# EAGLE schematic diybmsv4-00_panels (EAGLE 6.1)
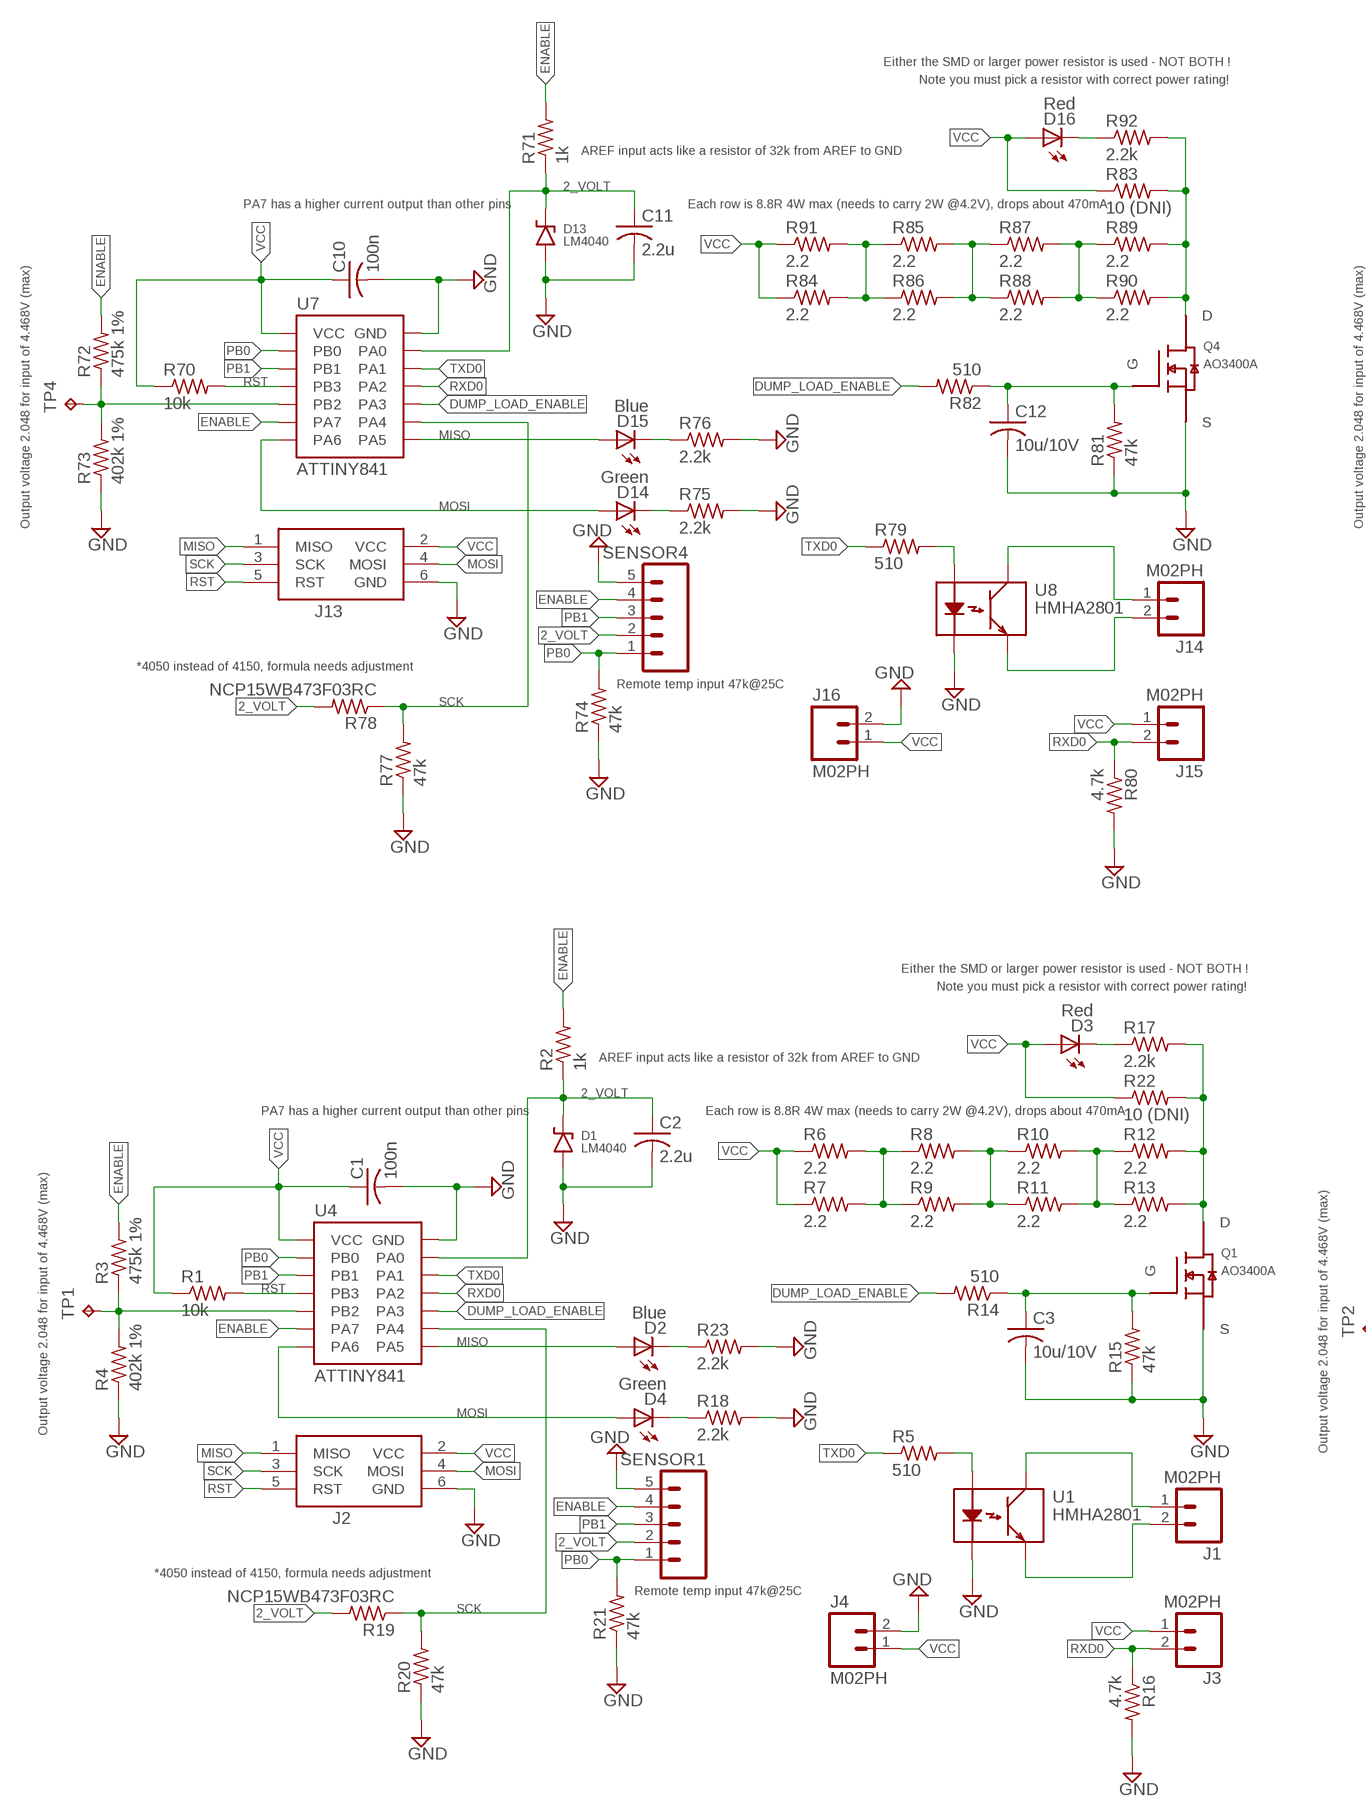
[diagram p0: schematic, sheet 1, part 1 of 2]
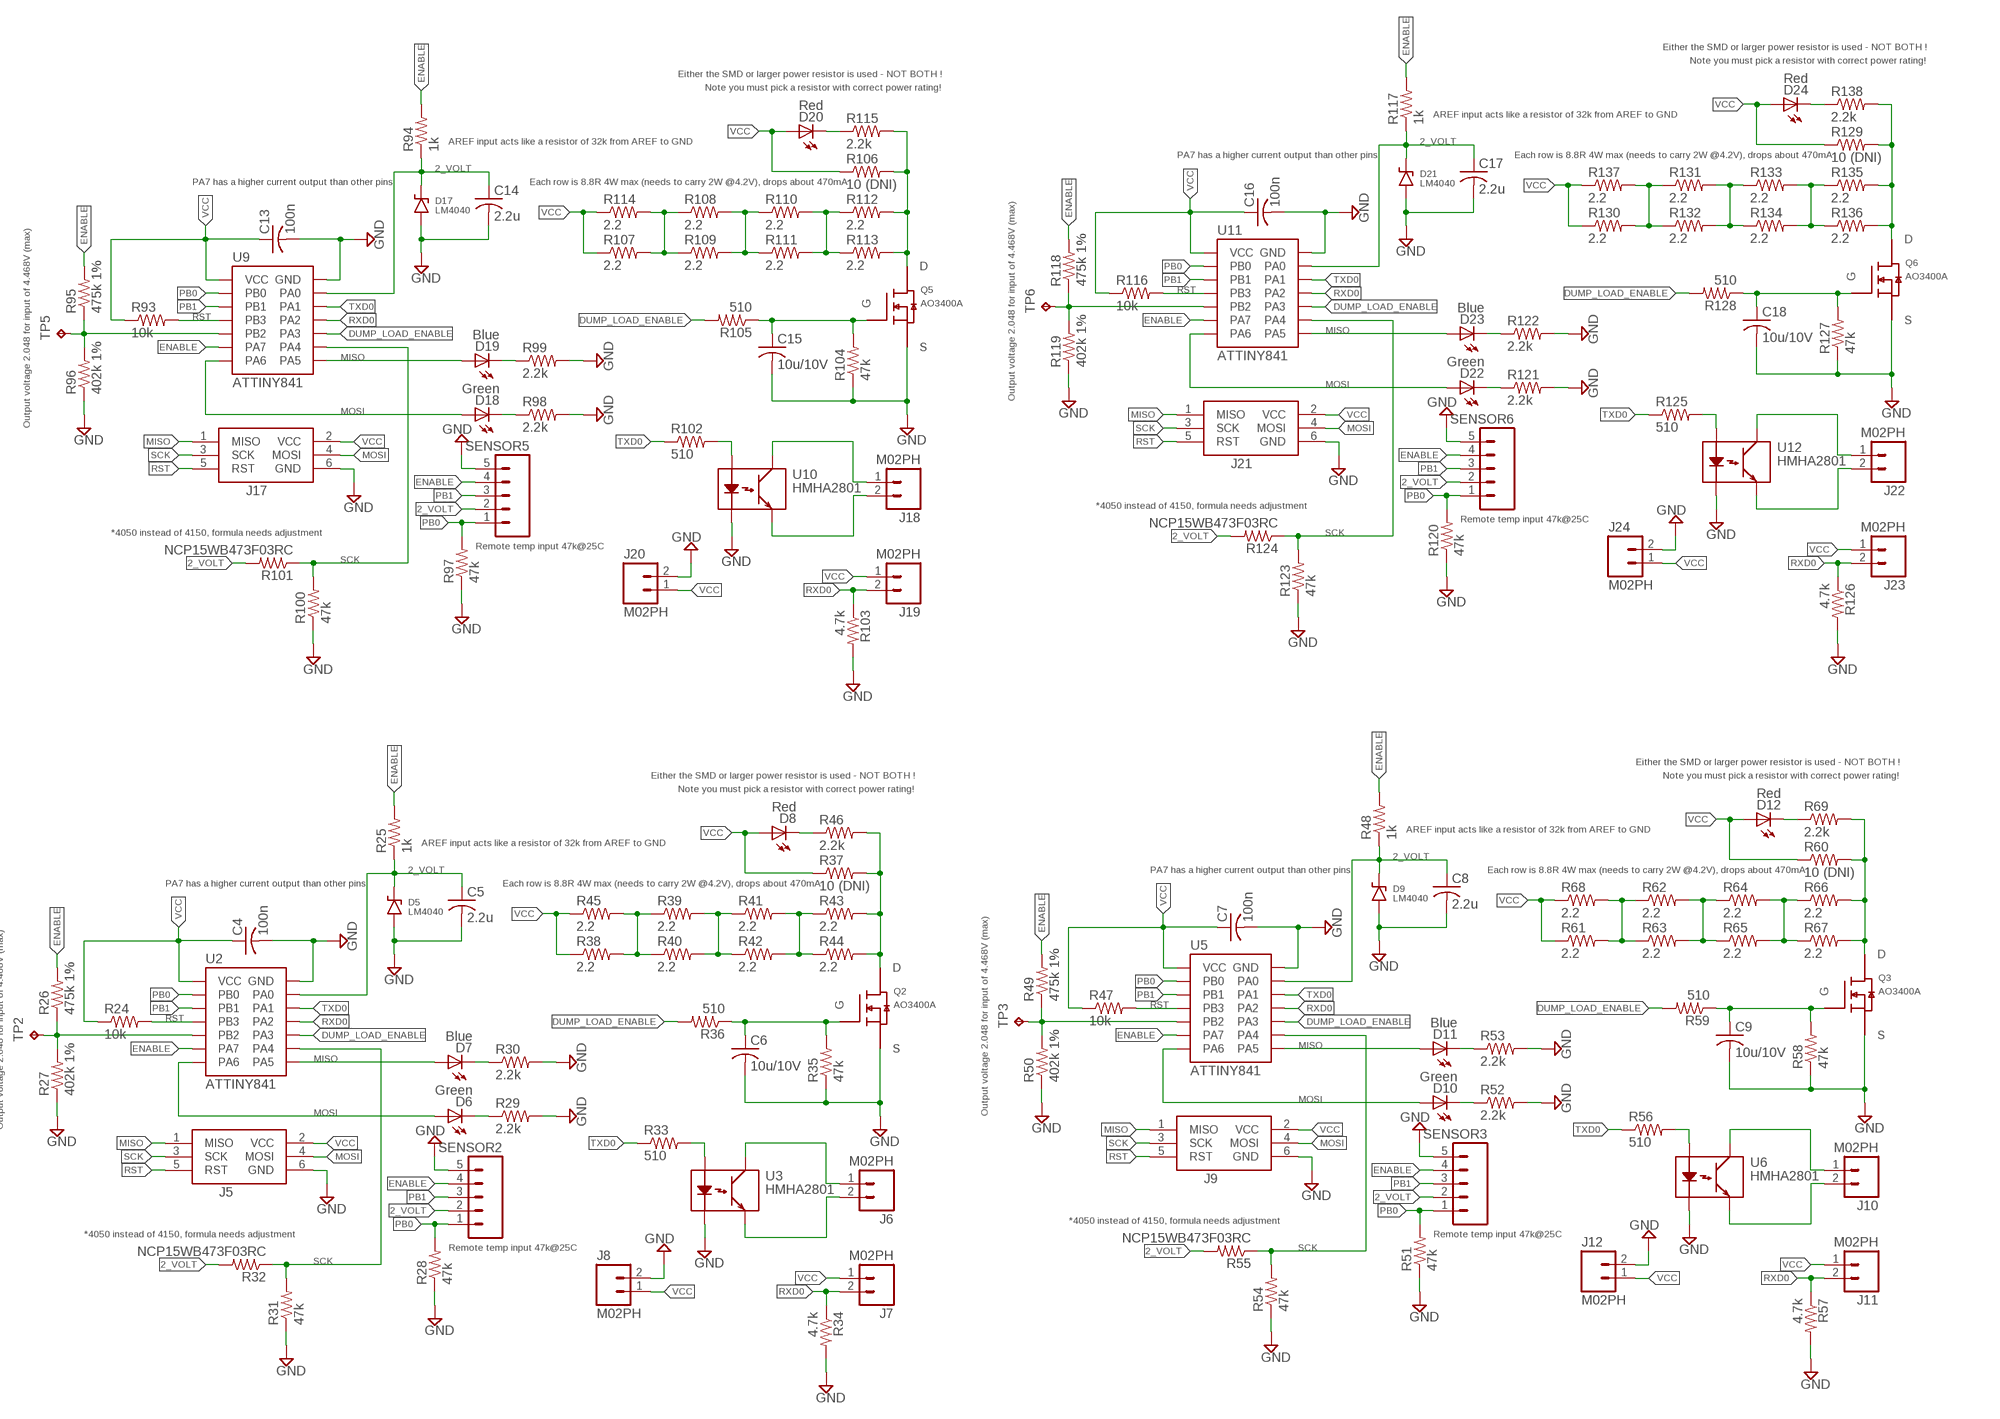
[diagram p1: schematic, sheet 1, part 2 of 2]

## Parts
C1  100n  C-USC0402  [C0402]
C2  2.2u  C-USC0402  [C0402]
C3  10u/10V  C-USC0402  [C0402]
C4  100n  C-USC0402  [C0402]
C5  2.2u  C-USC0402  [C0402]
C6  10u/10V  C-USC0402  [C0402]
C7  100n  C-USC0402  [C0402]
C8  2.2u  C-USC0402  [C0402]
C9  10u/10V  C-USC0402  [C0402]
C10  100n  C-USC0402  [C0402]
C11  2.2u  C-USC0402  [C0402]
C12  10u/10V  C-USC0402  [C0402]
C13  100n  C-USC0402  [C0402]
C14  2.2u  C-USC0402  [C0402]
C15  10u/10V  C-USC0402  [C0402]
C16  100n  C-USC0402  [C0402]
C17  2.2u  C-USC0402  [C0402]
C18  10u/10V  C-USC0402  [C0402]
D1  LM4040  [SOT23]
D2  Blue  LEDCHIPLED_0603  [CHIPLED_0603]
D3  Red  LEDCHIPLED_0603  [CHIPLED_0603]
D4  Green  LEDCHIPLED_0603  [CHIPLED_0603]
D5  LM4040  [SOT23]
D6  Green  LEDCHIPLED_0603  [CHIPLED_0603]
D7  Blue  LEDCHIPLED_0603  [CHIPLED_0603]
D8  Red  LEDCHIPLED_0603  [CHIPLED_0603]
D9  LM4040  [SOT23]
D10  Green  LEDCHIPLED_0603  [CHIPLED_0603]
D11  Blue  LEDCHIPLED_0603  [CHIPLED_0603]
D12  Red  LEDCHIPLED_0603  [CHIPLED_0603]
D13  LM4040  [SOT23]
D14  Green  LEDCHIPLED_0603  [CHIPLED_0603]
D15  Blue  LEDCHIPLED_0603  [CHIPLED_0603]
D16  Red  LEDCHIPLED_0603  [CHIPLED_0603]
D17  LM4040  [SOT23]
D18  Green  LEDCHIPLED_0603  [CHIPLED_0603]
D19  Blue  LEDCHIPLED_0603  [CHIPLED_0603]
D20  Red  LEDCHIPLED_0603  [CHIPLED_0603]
D21  LM4040  [SOT23]
D22  Green  LEDCHIPLED_0603  [CHIPLED_0603]
D23  Blue  LEDCHIPLED_0603  [CHIPLED_0603]
D24  Red  LEDCHIPLED_0603  [CHIPLED_0603]
J1  M02PH  [S2B-PH-RA]
J2  AVRISP-6  [AVRISP]
J3  M02PH  [S2B-PH-RA]
J4  M02PH  [S2B-PH-RA]
J5  AVRISP-6  [AVRISP]
J6  M02PH  [S2B-PH-RA]
J7  M02PH  [S2B-PH-RA]
J8  M02PH  [S2B-PH-RA]
J9  AVRISP-6  [AVRISP]
J10  M02PH  [S2B-PH-RA]
J11  M02PH  [S2B-PH-RA]
J12  M02PH  [S2B-PH-RA]
J13  AVRISP-6  [AVRISP]
J14  M02PH  [S2B-PH-RA]
J15  M02PH  [S2B-PH-RA]
J16  M02PH  [S2B-PH-RA]
J17  AVRISP-6  [AVRISP]
J18  M02PH  [S2B-PH-RA]
J19  M02PH  [S2B-PH-RA]
J20  M02PH  [S2B-PH-RA]
J21  AVRISP-6  [AVRISP]
J22  M02PH  [S2B-PH-RA]
J23  M02PH  [S2B-PH-RA]
J24  M02PH  [S2B-PH-RA]
Q1  AO3400A  AO3414  [SOT23]
Q2  AO3400A  AO3414  [SOT23]
Q3  AO3400A  AO3414  [SOT23]
Q4  AO3400A  AO3414  [SOT23]
Q5  AO3400A  AO3414  [SOT23]
Q6  AO3400A  AO3414  [SOT23]
R1  10k  R-US_R0402  [R0402]
R2  1k  R-US_R0402  [R0402]
R3  475k 1%  R-US_R0402  [R0402]
R4  402k 1%  R-US_R0402  [R0402]
R5  510  R-US_R0402  [R0402]
R6  2.2  R-US_R2512  [R2512]
R7  2.2  R-US_R2512  [R2512]
R8  2.2  R-US_R2512  [R2512]
R9  2.2  R-US_R2512  [R2512]
R10  2.2  R-US_R2512  [R2512]
R11  2.2  R-US_R2512  [R2512]
R12  2.2  R-US_R2512  [R2512]
R13  2.2  R-US_R2512  [R2512]
R14  510  R-US_R0402  [R0402]
R15  47k  R-US_R0402  [R0402]
R16  4.7k  R-US_R0402  [R0402]
R17  2.2k  R-US_R0402  [R0402]
R18  2.2k  R-US_R0402  [R0402]
R19  NCP15WB473F03RC  R-US_R0402  [R0402]
R20  47k  R-US_R0402  [R0402]
R21  47k  R-US_R0402  [R0402]
R22  10 (DNI)  RESISTOR25MM  [R-5W-22X9P5X9P5]
R23  2.2k  R-US_R0402  [R0402]
R24  10k  R-US_R0402  [R0402]
R25  1k  R-US_R0402  [R0402]
R26  475k 1%  R-US_R0402  [R0402]
R27  402k 1%  R-US_R0402  [R0402]
R28  47k  R-US_R0402  [R0402]
R29  2.2k  R-US_R0402  [R0402]
R30  2.2k  R-US_R0402  [R0402]
R31  47k  R-US_R0402  [R0402]
R32  NCP15WB473F03RC  R-US_R0402  [R0402]
R33  510  R-US_R0402  [R0402]
R34  4.7k  R-US_R0402  [R0402]
R35  47k  R-US_R0402  [R0402]
R36  510  R-US_R0402  [R0402]
R37  10 (DNI)  RESISTOR25MM  [R-5W-22X9P5X9P5]
R38  2.2  R-US_R2512  [R2512]
R39  2.2  R-US_R2512  [R2512]
R40  2.2  R-US_R2512  [R2512]
R41  2.2  R-US_R2512  [R2512]
R42  2.2  R-US_R2512  [R2512]
R43  2.2  R-US_R2512  [R2512]
R44  2.2  R-US_R2512  [R2512]
R45  2.2  R-US_R2512  [R2512]
R46  2.2k  R-US_R0402  [R0402]
R47  10k  R-US_R0402  [R0402]
R48  1k  R-US_R0402  [R0402]
R49  475k 1%  R-US_R0402  [R0402]
R50  402k 1%  R-US_R0402  [R0402]
R51  47k  R-US_R0402  [R0402]
R52  2.2k  R-US_R0402  [R0402]
R53  2.2k  R-US_R0402  [R0402]
R54  47k  R-US_R0402  [R0402]
R55  NCP15WB473F03RC  R-US_R0402  [R0402]
R56  510  R-US_R0402  [R0402]
R57  4.7k  R-US_R0402  [R0402]
R58  47k  R-US_R0402  [R0402]
R59  510  R-US_R0402  [R0402]
R60  10 (DNI)  RESISTOR25MM  [R-5W-22X9P5X9P5]
R61  2.2  R-US_R2512  [R2512]
R62  2.2  R-US_R2512  [R2512]
R63  2.2  R-US_R2512  [R2512]
R64  2.2  R-US_R2512  [R2512]
R65  2.2  R-US_R2512  [R2512]
R66  2.2  R-US_R2512  [R2512]
R67  2.2  R-US_R2512  [R2512]
R68  2.2  R-US_R2512  [R2512]
R69  2.2k  R-US_R0402  [R0402]
R70  10k  R-US_R0402  [R0402]
R71  1k  R-US_R0402  [R0402]
R72  475k 1%  R-US_R0402  [R0402]
R73  402k 1%  R-US_R0402  [R0402]
R74  47k  R-US_R0402  [R0402]
R75  2.2k  R-US_R0402  [R0402]
R76  2.2k  R-US_R0402  [R0402]
R77  47k  R-US_R0402  [R0402]
R78  NCP15WB473F03RC  R-US_R0402  [R0402]
R79  510  R-US_R0402  [R0402]
R80  4.7k  R-US_R0402  [R0402]
R81  47k  R-US_R0402  [R0402]
R82  510  R-US_R0402  [R0402]
R83  10 (DNI)  RESISTOR25MM  [R-5W-22X9P5X9P5]
R84  2.2  R-US_R2512  [R2512]
R85  2.2  R-US_R2512  [R2512]
R86  2.2  R-US_R2512  [R2512]
R87  2.2  R-US_R2512  [R2512]
R88  2.2  R-US_R2512  [R2512]
R89  2.2  R-US_R2512  [R2512]
R90  2.2  R-US_R2512  [R2512]
R91  2.2  R-US_R2512  [R2512]
R92  2.2k  R-US_R0402  [R0402]
R93  10k  R-US_R0402  [R0402]
R94  1k  R-US_R0402  [R0402]
R95  475k 1%  R-US_R0402  [R0402]
R96  402k 1%  R-US_R0402  [R0402]
R97  47k  R-US_R0402  [R0402]
R98  2.2k  R-US_R0402  [R0402]
R99  2.2k  R-US_R0402  [R0402]
R100  47k  R-US_R0402  [R0402]
R101  NCP15WB473F03RC  R-US_R0402  [R0402]
R102  510  R-US_R0402  [R0402]
R103  4.7k  R-US_R0402  [R0402]
R104  47k  R-US_R0402  [R0402]
R105  510  R-US_R0402  [R0402]
R106  10 (DNI)  RESISTOR25MM  [R-5W-22X9P5X9P5]
R107  2.2  R-US_R2512  [R2512]
R108  2.2  R-US_R2512  [R2512]
R109  2.2  R-US_R2512  [R2512]
R110  2.2  R-US_R2512  [R2512]
R111  2.2  R-US_R2512  [R2512]
R112  2.2  R-US_R2512  [R2512]
R113  2.2  R-US_R2512  [R2512]
R114  2.2  R-US_R2512  [R2512]
R115  2.2k  R-US_R0402  [R0402]
R116  10k  R-US_R0402  [R0402]
R117  1k  R-US_R0402  [R0402]
R118  475k 1%  R-US_R0402  [R0402]
R119  402k 1%  R-US_R0402  [R0402]
R120  47k  R-US_R0402  [R0402]
R121  2.2k  R-US_R0402  [R0402]
R122  2.2k  R-US_R0402  [R0402]
R123  47k  R-US_R0402  [R0402]
R124  NCP15WB473F03RC  R-US_R0402  [R0402]
R125  510  R-US_R0402  [R0402]
R126  4.7k  R-US_R0402  [R0402]
R127  47k  R-US_R0402  [R0402]
R128  510  R-US_R0402  [R0402]
R129  10 (DNI)  RESISTOR25MM  [R-5W-22X9P5X9P5]
R130  2.2  R-US_R2512  [R2512]
R131  2.2  R-US_R2512  [R2512]
R132  2.2  R-US_R2512  [R2512]
R133  2.2  R-US_R2512  [R2512]
R134  2.2  R-US_R2512  [R2512]
R135  2.2  R-US_R2512  [R2512]
R136  2.2  R-US_R2512  [R2512]
R137  2.2  R-US_R2512  [R2512]
R138  2.2k  R-US_R0402  [R0402]
SENSOR1  M05PTH  [1X05]
SENSOR2  M05PTH  [1X05]
SENSOR3  M05PTH  [1X05]
SENSOR4  M05PTH  [1X05]
SENSOR5  M05PTH  [1X05]
SENSOR6  M05PTH  [1X05]
TP1  TPTP15SQ  [TP15SQ]
TP2  TPTP15SQ  [TP15SQ]
TP3  TPTP15SQ  [TP15SQ]
TP4  TPTP15SQ  [TP15SQ]
TP5  TPTP15SQ  [TP15SQ]
TP6  TPTP15SQ  [TP15SQ]
U1  HMHA2801  [4-SOIC]
U2  ATTINY841  [14-SOIC]
U3  HMHA2801  [4-SOIC]
U4  ATTINY841  [14-SOIC]
U5  ATTINY841  [14-SOIC]
U6  HMHA2801  [4-SOIC]
U7  ATTINY841  [14-SOIC]
U8  HMHA2801  [4-SOIC]
U9  ATTINY841  [14-SOIC]
U10  HMHA2801  [4-SOIC]
U11  ATTINY841  [14-SOIC]
U12  HMHA2801  [4-SOIC]

## Nets
2_VOLT: C2.1 C5.1 C8.1 C11.1 C14.1 C17.1 D1.1(K) D5.1(K) D9.1(K) D13.1(K) D17.1(K) D21.1(K) R2.1 R19.2 R25.1 R32.2 R48.1 R55.2 R71.1 R78.2 R94.1 R101.2 R117.1 R124.2 SENSOR1.2 SENSOR2.2 SENSOR3.2 SENSOR4.2 SENSOR5.2 SENSOR6.2 U2.13(PA0) U4.13(PA0) U5.13(PA0) U7.13(PA0) U9.13(PA0) U11.13(PA0)
DLLED: D3.C R17.1
DLLED1: D8.C R46.1
DLLED2: D12.C R69.1
DLLED3: D16.C R92.1
DLLED4: D20.C R115.1
DLLED5: D24.C R138.1
DRAIN: Q1.3(D) R12.2 R13.2 R17.2 R22.2
DRAIN1: Q2.3(D) R37.2 R43.2 R44.2 R46.2
DRAIN2: Q3.3(D) R60.2 R66.2 R67.2 R69.2
DRAIN3: Q4.3(D) R83.2 R89.2 R90.2 R92.2
DRAIN4: Q5.3(D) R106.2 R112.2 R113.2 R115.2
DRAIN5: Q6.3(D) R129.2 R135.2 R136.2 R138.2
DUMP_LOAD_ENABLE: R14.2 R36.2 R59.2 R82.2 R105.2 R128.2 U2.10(PA3) U4.10(PA3) U5.10(PA3) U7.10(PA3) U9.10(PA3) U11.10(PA3)
ENABLE: R2.2 R3.2 R25.2 R26.2 R48.2 R49.2 R71.2 R72.2 R94.2 R95.2 R117.2 R118.2 SENSOR1.4 SENSOR2.4 SENSOR3.4 SENSOR4.4 SENSOR5.4 SENSOR6.4 U2.6(PA7) U4.6(PA7) U5.6(PA7) U7.6(PA7) U9.6(PA7) U11.6(PA7)
GATE: C3.1 Q1.1(G) R14.1 R15.2
GATE1: C6.1 Q2.1(G) R35.2 R36.1
GATE2: C9.1 Q3.1(G) R58.2 R59.1
GATE3: C12.1 Q4.1(G) R81.2 R82.1
GATE4: C15.1 Q5.1(G) R104.2 R105.1
GATE5: C18.1 Q6.1(G) R127.2 R128.1
GND: C1.2 C2.2 C3.2 C4.2 C5.2 C6.2 C7.2 C8.2 C9.2 C10.2 C11.2 C12.2 C13.2 C14.2 C15.2 C16.2 C17.2 C18.2 D1.2(A) D5.2(A) D9.2(A) D13.2(A) D17.2(A) D21.2(A) J2.6(GND) J4.2 J5.6(GND) J8.2 J9.6(GND) J12.2 J13.6(GND) J16.2 J17.6(GND) J20.2 J21.6(GND) J24.2 Q1.2(S) Q2.2(S) Q3.2(S) Q4.2(S) Q5.2(S) Q6.2(S) R4.1 R15.1 R16.2 R18.2 R20.1 R21.1 R23.2 R27.1 R28.1 R29.2 R30.2 R31.1 R34.2 R35.1 R50.1 R51.1 R52.2 R53.2 R54.1 R57.2 R58.1 R73.1 R74.1 R75.2 R76.2 R77.1 R80.2 R81.1 R96.1 R97.1 R98.2 R99.2 R100.1 R103.2 R104.1 R119.1 R120.1 R121.2 R122.2 R123.1 R126.2 R127.1 SENSOR1.5 SENSOR2.5 SENSOR3.5 SENSOR4.5 SENSOR5.5 SENSOR6.5 U1.2(K) U2.14(GND) U3.2(K) U4.14(GND) U5.14(GND) U6.2(K) U7.14(GND) U8.2(K) U9.14(GND) U10.2(K) U11.14(GND) U12.2(K)
MISO: D2.A D7.A D11.A D15.A D19.A D23.A J2.1(MISO) J5.1(MISO) J9.1(MISO) J13.1(MISO) J17.1(MISO) J21.1(MISO) U2.8(PA5) U4.8(PA5) U5.8(PA5) U7.8(PA5) U9.8(PA5) U11.8(PA5)
MOSI: D4.A D6.A D10.A D14.A D18.A D22.A J2.4(MOSI) J5.4(MOSI) J9.4(MOSI) J13.4(MOSI) J17.4(MOSI) J21.4(MOSI) U2.7(PA6) U4.7(PA6) U5.7(PA6) U7.7(PA6) U9.7(PA6) U11.7(PA6)
N$1: J1.1 U1.4(C)
N$2: J1.2 U1.3(E)
N$3: D4.C R18.1
N$4: D2.C R23.1
N$5: R5.2 U1.1(A)
N$6: D6.C R29.1
N$7: D7.C R30.1
N$8: J6.1 U3.4(C)
N$9: J6.2 U3.3(E)
N$10: R33.2 U3.1(A)
N$11: D10.C R52.1
N$12: D11.C R53.1
N$13: J10.1 U6.4(C)
N$14: J10.2 U6.3(E)
N$15: R56.2 U6.1(A)
N$16: D14.C R75.1
N$17: D15.C R76.1
N$18: J14.1 U8.4(C)
N$19: J14.2 U8.3(E)
N$20: R79.2 U8.1(A)
N$21: D18.C R98.1
N$22: D19.C R99.1
N$23: J18.1 U10.4(C)
N$24: J18.2 U10.3(E)
N$25: R102.2 U10.1(A)
N$26: D22.C R121.1
N$27: D23.C R122.1
N$28: J22.1 U12.4(C)
N$29: J22.2 U12.3(E)
N$30: R125.2 U12.1(A)
PB0: R21.2 R28.2 R51.2 R74.2 R97.2 R120.2 SENSOR1.1 SENSOR2.1 SENSOR3.1 SENSOR4.1 SENSOR5.1 SENSOR6.1 U2.2(PB0) U4.2(PB0) U5.2(PB0) U7.2(PB0) U9.2(PB0) U11.2(PB0)
PB1: SENSOR1.3 SENSOR2.3 SENSOR3.3 SENSOR4.3 SENSOR5.3 SENSOR6.3 U2.3(PB1) U4.3(PB1) U5.3(PB1) U7.3(PB1) U9.3(PB1) U11.3(PB1)
PB2: R3.1 R4.2 TP1.TP U4.5(PB2)
PB3: R26.1 R27.2 TP2.TP U2.5(PB2)
PB4: R49.1 R50.2 TP3.TP U5.5(PB2)
PB5: R72.1 R73.2 TP4.TP U7.5(PB2)
PB6: R95.1 R96.2 TP5.TP U9.5(PB2)
PB7: R118.1 R119.2 TP6.TP U11.5(PB2)
R1: R39.2 R40.2 R41.1 R42.1
R2: R41.2 R42.2 R43.1 R44.1
R3: R38.2 R39.1 R40.1 R45.2
R4: R62.2 R63.2 R64.1 R65.1
R5: R64.2 R65.2 R66.1 R67.1
R6: R61.2 R62.1 R63.1 R68.2
R7: R85.2 R86.2 R87.1 R88.1
R8: R87.2 R88.2 R89.1 R90.1
R9: R84.2 R85.1 R86.1 R91.2
R10: R108.2 R109.2 R110.1 R111.1
R11: R110.2 R111.2 R112.1 R113.1
R12: R107.2 R108.1 R109.1 R114.2
R13: R131.2 R132.2 R133.1 R134.1
R14: R133.2 R134.2 R135.1 R136.1
R15: R130.2 R131.1 R132.1 R137.2
R6789: R6.2 R7.2 R8.1 R9.1
R891011: R8.2 R9.2 R10.1 R11.1
R10111213: R10.2 R11.2 R12.1 R13.1
RST: J2.5(RST) J5.5(RST) J9.5(RST) J13.5(RST) J17.5(RST) J21.5(RST) R1.2 R24.2 R47.2 R70.2 R93.2 R116.2 U2.4(PB3) U4.4(PB3) U5.4(PB3) U7.4(PB3) U9.4(PB3) U11.4(PB3)
RXD0: J3.2 J7.2 J11.2 J15.2 J19.2 J23.2 R16.1 R34.1 R57.1 R80.1 R103.1 R126.1 U2.11(PA2) U4.11(PA2) U5.11(PA2) U7.11(PA2) U9.11(PA2) U11.11(PA2)
SCK: J2.3(SCK) J5.3(SCK) J9.3(SCK) J13.3(SCK) J17.3(SCK) J21.3(SCK) R19.1 R20.2 R31.2 R32.1 R54.2 R55.1 R77.2 R78.1 R100.2 R101.1 R123.2 R124.1 U2.9(PA4) U4.9(PA4) U5.9(PA4) U7.9(PA4) U9.9(PA4) U11.9(PA4)
TXD0: R5.1 R33.1 R56.1 R79.1 R102.1 R125.1 U2.12(PA1) U4.12(PA1) U5.12(PA1) U7.12(PA1) U9.12(PA1) U11.12(PA1)
VCC: C1.1 C4.1 C7.1 C10.1 C13.1 C16.1 D3.A D8.A D12.A D16.A D20.A D24.A J2.2(VCC) J3.1 J4.1 J5.2(VCC) J7.1 J8.1 J9.2(VCC) J11.1 J12.1 J13.2(VCC) J15.1 J16.1 J17.2(VCC) J19.1 J20.1 J21.2(VCC) J23.1 J24.1 R1.1 R6.1 R7.1 R22.1 R24.1 R37.1 R38.1 R45.1 R47.1 R60.1 R61.1 R68.1 R70.1 R83.1 R84.1 R91.1 R93.1 R106.1 R107.1 R114.1 R116.1 R129.1 R130.1 R137.1 U2.1(VCC) U4.1(VCC) U5.1(VCC) U7.1(VCC) U9.1(VCC) U11.1(VCC)

## Notes on the sheet
- Either the SMD or larger power resistor is used - NOT BOTH !
- Note you must pick a resistor with correct power rating!
- Either the SMD or larger power resistor is used - NOT BOTH ! | Either the SMD or larger power resistor is used - NOT BOTH !
- Note you must pick a resistor with correct power rating! | Note you must pick a resistor with correct power rating!
- AREF input acts like a resistor of 32k from AREF to GND
- AREF input acts like a resistor of 32k from AREF to GND | AREF input acts like a resistor of 32k from AREF to GND
- PA7 has a higher current output than other pins | Each row is 8.8R 4W max (needs to carry 2W @4.2V), drops about 470mA
- PA7 has a higher current output than other pins | Each row is 8.8R 4W max (needs to carry 2W @4.2V), drops about 470mA | PA7 has a higher current output than other pins | Each row is 8.8R 4W max (needs to carry 2W @4.2V), drops about 470mA
- Output voltage 2.048 for input of 4.468V (max)
- Output voltage 2.048 for input of 4.468V (max) | Output voltage 2.048 for input of 4.468V (max)
- *4050 instead of 4150, formula needs adjustment
- Remote temp input 47k@25C
- *4050 instead of 4150, formula needs adjustment | *4050 instead of 4150, formula needs adjustment
- Remote temp input 47k@25C | Remote temp input 47k@25C
- Either the SMD or larger power resistor is used - NOT BOTH ! | Either the SMD or larger power resistor is used - NOT BOTH !
- Note you must pick a resistor with correct power rating! | Either the SMD or larger power resistor is used - NOT BOTH ! | Note you must pick a resistor with correct power rating!
- Note you must pick a resistor with correct power rating!
- AREF input acts like a resistor of 32k from AREF to GND | AREF input acts like a resistor of 32k from AREF to GND
- AREF input acts like a resistor of 32k from AREF to GND
- PA7 has a higher current output than other pins | Each row is 8.8R 4W max (needs to carry 2W @4.2V), drops about 470mA | PA7 has a higher current output than other pins | Each row is 8.8R 4W max (needs to carry 2W @4.2V), drops about 470mA
- PA7 has a higher current output than other pins | Each row is 8.8R 4W max (needs to carry 2W @4.2V), drops about 470mA
- Output voltage 2.048 for input of 4.468V (max) | Output voltage 2.048 for input of 4.468V (max)
- Output voltage 2.048 for input of 4.468V (max)
- *4050 instead of 4150, formula needs adjustment | *4050 instead of 4150, formula needs adjustment
- Remote temp input 47k@25C | *4050 instead of 4150, formula needs adjustment | Remote temp input 47k@25C
- Remote temp input 47k@25C

## Library data of the parts
C1-C18 = resistor:C-US: CAPACITOR, American symbol
D1 D5 D9 D13 D17 D21 = custom:LM4040: Voltage Reference Shunt 73uA
D2-D4 D6-D8 D10-D12 D14-D16 D18-D20 D22-D24 = led:LED: LED OSRAM: - CHIPLED LG R971, LG N971, LY N971, LG Q971, LY Q971, LO R971, LY R971 LH N974, LH R974 LS Q976, LO Q976, LY Q976 LO Q996 - Hyper CHIPLED LW Q18S LB Q993, LB Q99A, LB R99A - SideLED LS A670, LO A670, LY A670, LG A670, LP A670 LB A673, LV A673, LT A673, LW A673 LH A674 LY A675 LS A676, LA A676, LO A676, LY A676, LW A676 LS A679, LY A679, LG A679 - Hyper Micro SIDELED® LS Y876, LA Y876, LO Y876, LY Y876 LT Y87S - SmartLED LW L88C, LW L88S LB L89C, LB L89S, LG L890 LS L89K, LO L89K, LY L89K LS L896, LA L896, LO L896, LY L896 - TOPLED LS T670, LO T670, LY T670, LG T670, LP T670 LSG T670, LSP T670, LSY T670, LOP T670, LYG T670 LG T671, LOG T671, LSG T671 LB T673, LV T673, LT T673, LW T673 LH T674 LS T676, LA T676, LO T676, LY T676, LB T676, LH T676, LSB T676, LW T676 LB T67C, LV T67C, LT T67C, LS T67K, LO T67K, LY T67K, LW E67C LS E67B, LA E67B, LO E67B, LY E67B, LB E67C, LV E67C, LT E67C LW T67C LS T679, LY T679, LG T679 LS T770, LO T770, LY T770, LG T770, LP T770 LB T773, LV T773, LT T773, LW T773 LH T774 LS E675, LA E675, LY E675, LS T675 LS T776, LA T776, LO T776, LY T776, LB T776 LHGB T686 LT T68C, LB T68C - Hyper Mini TOPLED® LB M676 - Mini TOPLED Santana® LG M470 LS M47K, LO M47K, LY M47K Source: http://www.osram.convergy.de LUXEON: - LUMILED® LXK2-PW12-R00, LXK2-PW12-S00, LXK2-PW14-U00, LXK2-PW14-V00 LXK2-PM12-R00, LXK2-PM12-S00, LXK2-PM14-U00 LXK2-PE12-Q00, LXK2-PE12-R00, LXK2-PE12-S00, LXK2-PE14-T00, LXK2-PE14-U00 LXK2-PB12-K00, LXK2-PB12-L00, LXK2-PB12-M00, LXK2-PB14-N00, LXK2-PB14-P00, LXK2-PB14-Q00 LXK2-PR12-L00, LXK2-PR12-M00, LXK2-PR14-Q00, LXK2-PR14-R00 LXK2-PD12-Q00, LXK2-PD12-R00, LXK2-PD12-S00 LXK2-PH12-R00, LXK2-PH12-S00 LXK2-PL12-P00, LXK2-PL12-Q00, LXK2-PL12-R00 Source: www.luxeon.com KINGBRIGHT: KA-3528ASYC Source: www.kingbright.com
J1 J3 J4 J6-J8 J10-J12 J14-J16 J18-J20 J22-J24 = custom:M02
J2 J5 J9 J13 J17 J21 = adafruit:AVRISP: AVR ISP HEADER Standard 6 pin header for AVR programming
Q1-Q6 = custom:AO3414: N-Channel MOSFET Logic Level 20V 3A 1.8V 50mOhm
R1-R21 R23-R36 R38-R59 R61-R82 R84-R105 R107-R128 R130-R138 = resistor:R-US_: RESISTOR, American symbol
R22 R37 R60 R83 R106 R129 = custom:RESISTOR
SENSOR1-SENSOR6 = SparkFun:M05: Header 5 Standard 5-pin 0.1" header. Use with straight break away headers (SKU : PRT-00116), right angle break away headers (PRT-00553), swiss pins (PRT-00743), machine pins (PRT-00117), and female headers (PRT-00115). Molex polarized connector foot print use with SKU : PRT-08230 with associated crimp pins and housings.
TP1-TP6 = testpad:TP: Test pad
U1 U3 U6 U8 U10 U12 = custom:HMHA2801: Optoisolator Transistor Output 3.75kVrms Isolation 80V 50mA
U2 U4 U5 U7 U9 U11 = custom:ATTINY841: Atmel / Microchip 8-bit AVR Microcontroller 8KB 16MHz 512B EEPROM 512B SRAM 12x10b ADC